# EAGLE design Vario Kobo SIDE V1 (EAGLE 7.3.0)

## Sheet 1 of 2: Alimentation
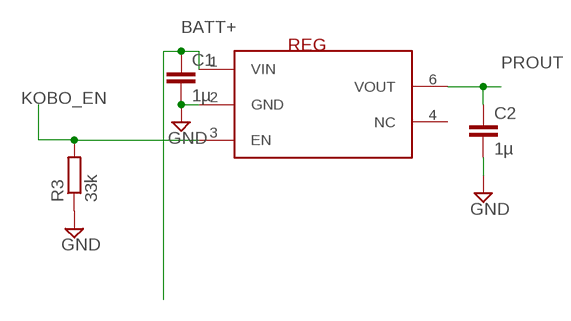
[diagram p0: schematic, sheet 1]

### Parts
C1  1µ  C-EUC0603  [C0603]
C2  1µ  C-EUC0603  [C0603]
R3  33k  R-EU_R0603  [R0603]
REG  ADP160/161/162/163  [TSOT23-6_DDC]

### Nets
BATT+: C1.1 REG.1(VIN) ; also sheet 2
GND: C1.2 C2.2 R3.1 REG.2(GND) ; also sheet 2
KOBO_EN: R3.2 REG.3(EN) ; also sheet 2
PROUT: C2.1 REG.6(VOUT) ; also sheet 2
Unconnected: REG.4(NC)

## Sheet 2 of 2: Vario Core
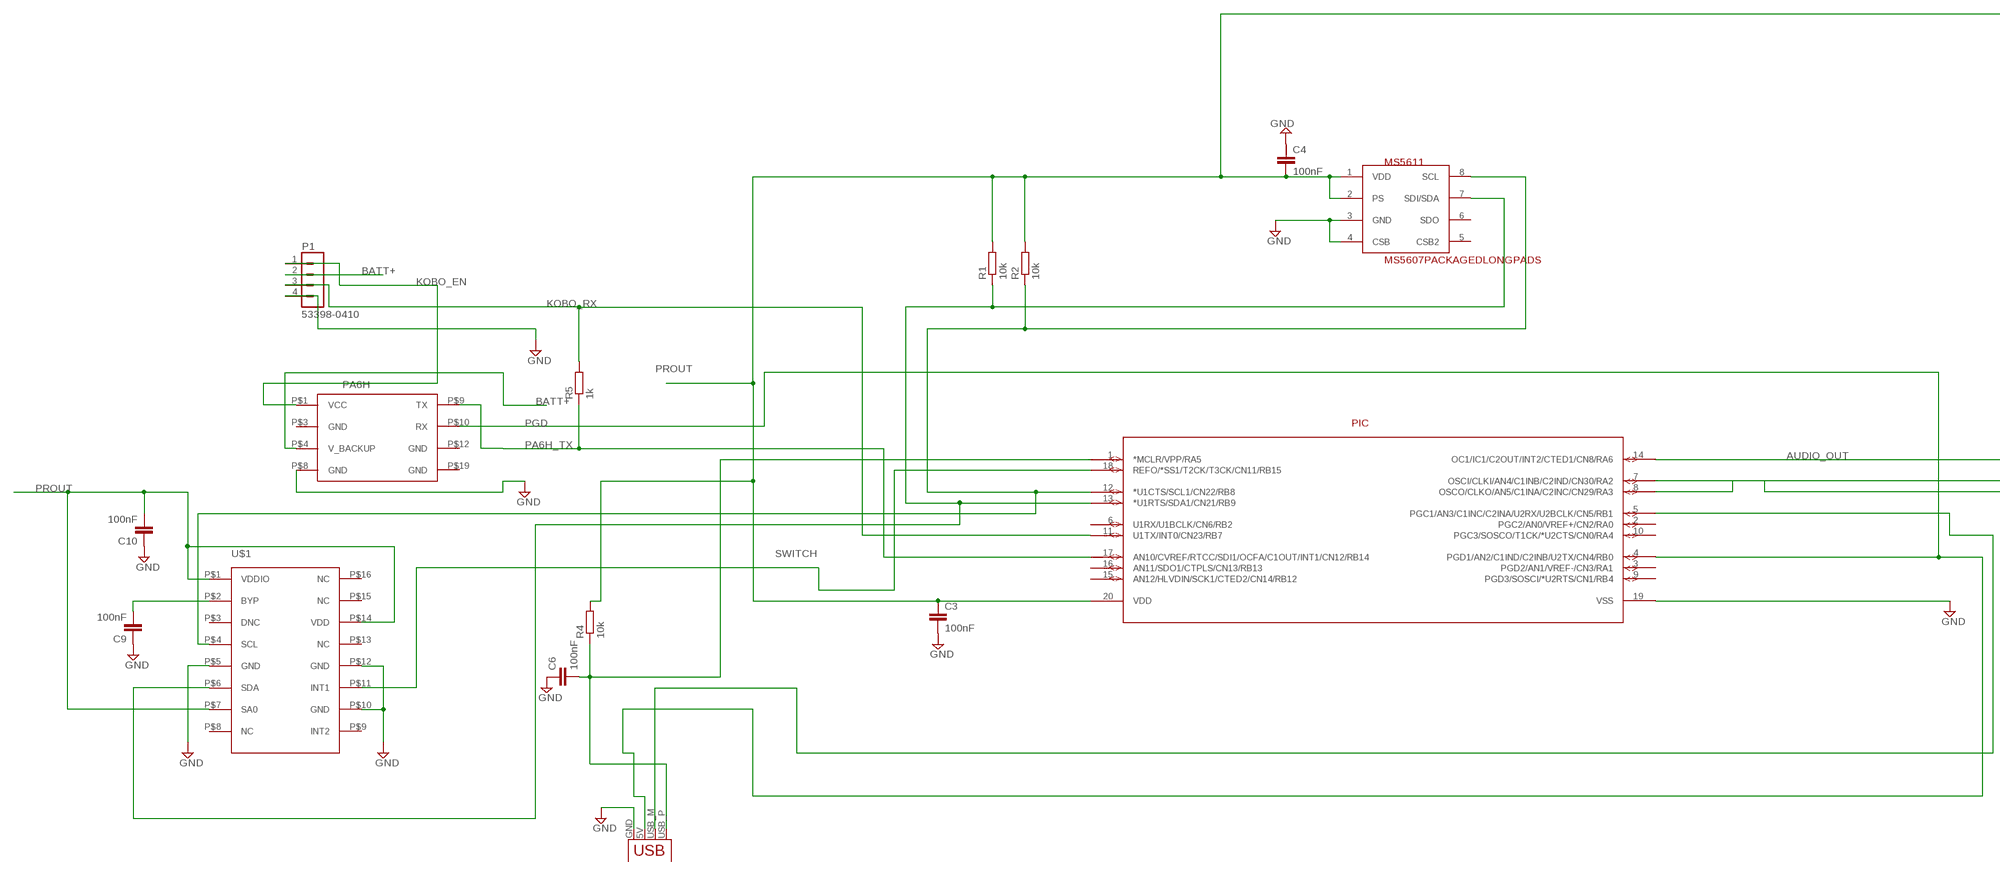
[diagram p1: schematic, sheet 2, part 1 of 2]
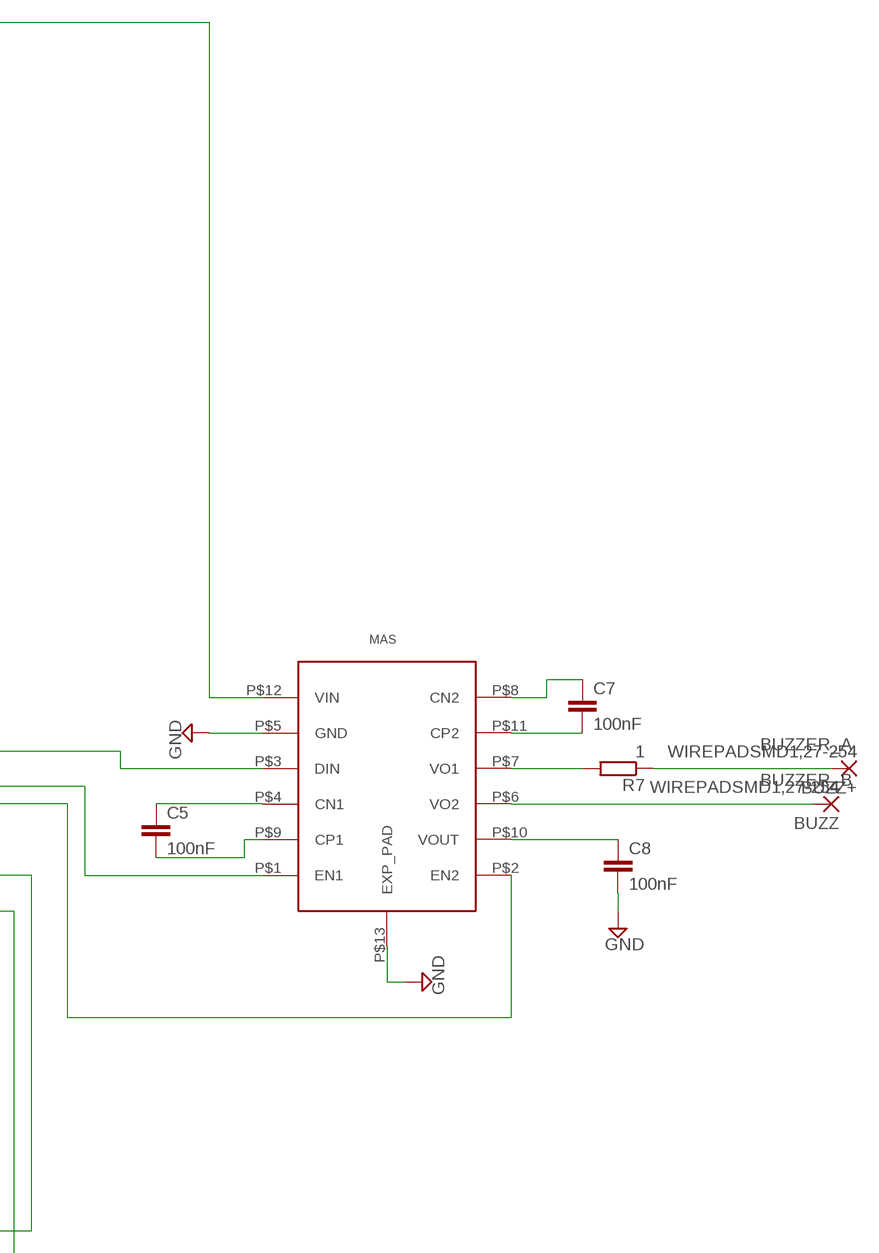
[diagram p2: schematic, sheet 2, part 2 of 2]

### Parts
BUZZ  WIREPADSMD1,27-254  [SMD1,27-2,54]
BUZZ+  WIREPADSMD1,27-254  [SMD1,27-2,54]
C3  100nF  C-EUC0603  [C0603]
C4  100nF  C-EUC0603  [C0603]
C5  100nF  C-EUC0603  [C0603]
C6  100nF  C-EUC0603  [C0603]
C7  100nF  C-EUC0603  [C0603]
C8  100nF  C-EUC0603  [C0603]
C9  100nF  C-EUC0603  [C0603]
C10  100nF  C-EUC0603  [C0603]
MAS  MAS6240  [QFN12_3X3_LONGPADS]
MS5611  MS5607PACKAGEDLONGPADS  [MS5607-02BA03_LONGPADS]
P1  53398-0410  [53398-0410]
PA6H  PA6H  [PA6H_PRINT]
PIC  PIC24F16KA101-X_  [SSOP20_MC]
R1  10k  R-EU_R0603  [R0603]
R2  10k  R-EU_R0603  [R0603]
R4  10k  R-EU_R0603  [R0603]
R5  1k  R-EU_R0603  [R0603]
R7  1  R-EU_R0603  [R0603]
U$1  MMA8452LONGPADS  [MMA845X_LONG_PADS]
X1  USBPCB  [USB-A-PCB]

### Nets
AUDIO_OUT: MAS.P$3(DIN) PIC.14(OC1/IC1/C2OUT/INT2/CTED1/CN8/RA6)
BATT+: P1.2 PA6H.P$4(V_BACKUP) ; also sheet 1
BUZZER_A: BUZZ+.1(P) R7.1
BUZZER_B: BUZZ.1(P) MAS.P$6(VO2)
GND: C3.2 C4.1 C6.1 C8.2 C9.1 C10.1 MAS.P$5(GND) MAS.P$13(EXP_PAD) MS5611.3(GND) MS5611.4(CSB) P1.4 PA6H.P$8(GND) PIC.19(VSS) U$1.P$5(GND) U$1.P$10(GND) U$1.P$12(GND) X1.GND ; also sheet 1
KOBO_EN: P1.1 PA6H.P$1(VCC) ; also sheet 1
KOBO_RX: P1.3 PIC.11(U1TX/INT0/CN23/RB7) R5.2
MCLR: C6.2 PIC.1(*MCLR/VPP/RA5) R4.1 X1.USB_P(D+)
N$3: C8.1 MAS.P$10(VOUT)
N$4: C5.1 MAS.P$4(CN1)
N$5: C5.2 MAS.P$9(CP1)
N$6: C7.2 MAS.P$11(CP2)
N$7: C7.1 MAS.P$8(CN2)
N$8: MAS.P$7(VO1) R7.2
N$9: MAS.P$1(EN1) PIC.8(OSCO/CLKO/AN5/C1INA/C2INC/CN29/RA3)
N$10: C9.2 U$1.P$2(BYP)
N$11: MAS.P$2(EN2) PIC.7(OSCI/CLKI/AN4/C1INB/C2IND/CN30/RA2)
PA6H_TX: PA6H.P$9(TX) PIC.17(AN10/CVREF/RTCC/SDI1/OCFA/C1OUT/INT1/CN12/RB14) R5.1
PGC: PIC.5(PGC1/AN3/C1INC/C2INA/U2RX/U2BCLK/CN5/RB1) X1.USB_M(D-)
PGD: PA6H.P$10(RX) PIC.4(PGD1/AN2/C1IND/C2INB/U2TX/CN4/RB0) X1.5V(VBUS)
PROUT: C3.1 C4.2 C10.2 MAS.P$12(VIN) MS5611.1(VDD) MS5611.2(PS) PIC.20(VDD) R1.2 R2.2 R4.2 U$1.P$1(VDDIO) U$1.P$7(SA0) U$1.P$14(VDD) ; also sheet 1
SCL: MS5611.8(SCL) PIC.12(*U1CTS/SCL1/CN22/RB8) R2.1 U$1.P$4(SCL)
SDA: MS5611.7(SDI/SDA) PIC.13(*U1RTS/SDA1/CN21/RB9) R1.1 U$1.P$6(SDA)
SWITCH: PIC.18(REFO/*SS1/T2CK/T3CK/CN11/RB15) U$1.P$11(INT1)
Unconnected: MS5611.5(CSB2) MS5611.6(SDO) PA6H.P$3(GND) PA6H.P$12(GND) PA6H.P$19(GND) PIC.2(PGC2/AN0/VREF+/CN2/RA0) PIC.3(PGD2/AN1/VREF-/CN3/RA1) PIC.6(U1RX/U1BCLK/CN6/RB2) PIC.9(PGD3/SOSCI/*U2RTS/CN1/RB4) PIC.10(PGC3/SOSCO/T1CK/*U2CTS/CN0/RA4) PIC.15(AN12/HLVDIN/SCK1/CTED2/CN14/RB12) PIC.16(AN11/SDO1/CTPLS/CN13/RB13) U$1.P$3(DNC) U$1.P$8(NC) U$1.P$9(INT2) U$1.P$13(NC) U$1.P$15(NC) U$1.P$16(NC)

## Library data of the parts
BUZZ BUZZ+ = wirepad:WIREPAD: Wire PAD connect wire on PCB
C1-C10 = rcl:C-EU: CAPACITOR, European symbol
MAS = mas:MAS6240
MS5611 = measurement_specialties:MS5607PACKAGED
P1 = con-molex-picoblade:53398-0410: HEADER
PA6H = gtop:PA6H
PIC = microchip:PIC24F16KA101-X_
R1-R5 R7 = rcl:R-EU_: RESISTOR, European symbol
REG = analog-devices:ADP160/161/162/163: LDO, low Iq Linear Voltage Regulator
U$1 = freescale:MMA8452
X1 = usb:USB: USB Connectors USB-B-PTH is fully proven SKU : PRT-00139 USB-miniB is fully proven SKU : PRT-00587 USB-A-PCB is untested. USB-A-H is throughly reviewed, but untested. Spark Fun Electronics SKU : PRT-00437 USB-B-SMT is throughly reviewed, but untested. Needs silkscreen touching up. USB-A-S has not been used/tested USB-MB-H has not been used/tested

## Board
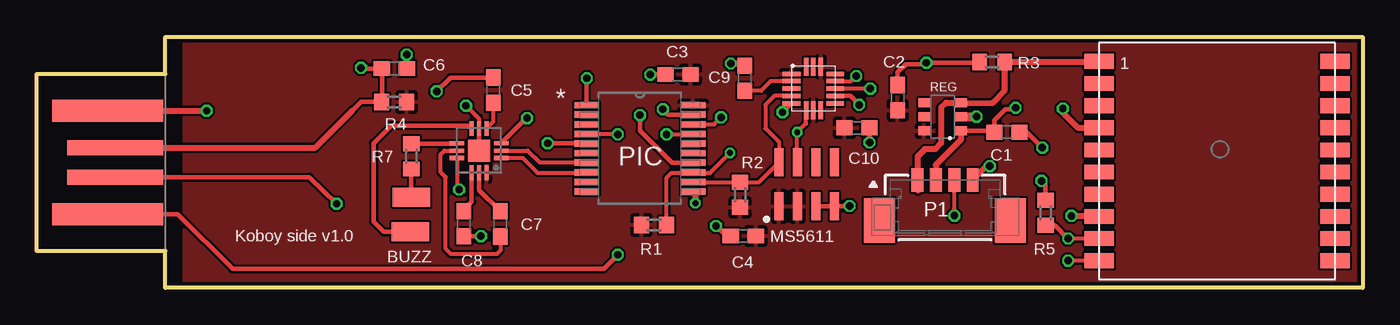
[diagram p3: board, top side]
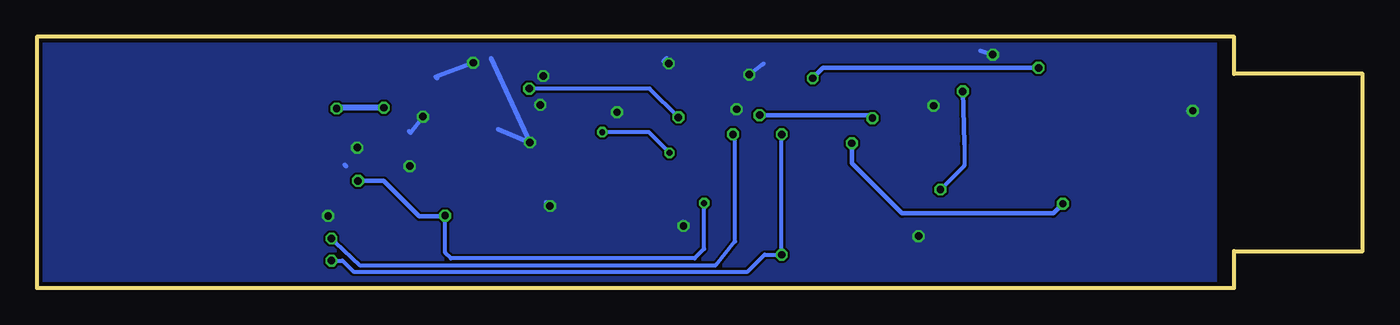
[diagram p4: board, bottom side, seen from below]

Size 89.8 x 17 mm. Coordinates in mm from the lower left corner, seen from the top.
Outline: 0,14.5 8.7,14.5 8.7,17 89.8,17 89.8,0 8.7,0 8.7,2.5 0,2.5 0,14.5
Copper layers (1*16): Top 0.035mm / dielectric 1.5mm / Bottom 0.035mm
Design rules "ITEADstudio_DRC": minimum track width 6mil, minimum drill 12mil, track to track 6mil, track to pad 6mil, pad to pad 6mil, via to via 6mil, smd to smd 0mil, copper to edge 10mil, drill to drill 10mil, minimum pad ring 10mil, minimum via ring 6mil, stop-mask expansion 2mil, vias tented up to drill 100mil, thermal gap 10mil

### Footprints (pad centres in the part's own frame; a part is rotated, then mirrored left to right if it is on the bottom)
SMD1,27-2,54 = smd 1.27 x 2.54: 1 0,0
C0603 = smd 1.1 x 1: 1 -0.85,0; 2 0.85,0
QFN12_3X3_LONGPADS = smd 0.28 x 1: P$1 -0.5,-1.5; P$2 0,-1.5; P$3 0.5,-1.5; P$7 0.5,1.5; P$8 0,1.5; P$9 -0.5,1.5 | smd 1 x 0.28: P$4 1.5,-0.5; P$5 1.5,0; P$6 1.5,0.5; P$10 -1.5,0.5; P$11 -1.5,0; P$12 -1.5,-0.5 | smd 1.5 x 1.5: P$13 0,0
MS5607-02BA03_LONGPADS = smd 1.9 x 0.6: 1 -0.4,0; 2 -0.4,-1.25; 3 -0.4,-2.5; 4 -0.4,-3.75; 5 2.6,-3.75; 6 2.6,-2.5; 7 2.6,-1.25; 8 2.6,0
53398-0410 = smd 0.8 x 1.6: 1 1.875,0; 2 0.625,0; 3 -0.625,0; 4 -1.875,0 | smd 2.1 x 3: M1 4.435,2.75; M2 -4.435,2.75
PA6H_PRINT = smd 2 x 1: P$1 -8,6.75; P$2 -8,5.25; P$3 -8,3.75; P$4 -8,2.25; P$5 -8,0.75; P$6 -8,-0.75; P$7 -8,-2.25; P$8 -8,-3.75; P$9 -8,-5.25; P$10 -8,-6.75; P$11 8,-6.75; P$12 8,-5.25; P$13 8,-3.75; P$14 8,-2.25; P$15 8,-0.75; P$16 8,0.75; P$17 8,2.25; P$18 8,3.75; P$19 8,5.25; P$20 8,6.75
SSOP20_MC = smd 1.676 x 0.432: 1 -3.607,2.921; 2 -3.607,2.286; 3 -3.607,1.626; 4 -3.607,0.965; 5 -3.607,0.33; 6 -3.607,-0.33; 7 -3.607,-0.965; 8 -3.607,-1.626; 9 -3.607,-2.286; 10 -3.607,-2.921; 11 3.607,-2.921; 12 3.607,-2.286; 13 3.607,-1.626; 14 3.607,-0.965; 15 3.607,-0.33; 16 3.607,0.33; 17 3.607,0.965; 18 3.607,1.626; 19 3.607,2.286; 20 3.607,2.921
R0603 = smd 1 x 1.1: 1 -0.85,0; 2 0.85,0
TSOT23-6_DDC = smd 0.6 x 0.8: 1 -0.95,-1.25; 2 0,-1.25; 3 0.95,-1.25; 4 0.95,1.25; 5 0,1.25; 6 -0.95,1.25
MMA845X_LONG_PADS = smd 1.213 x 0.305: P$1 -1.475,1; P$2 -1.475,0.5; P$3 -1.475,0; P$4 -1.475,-0.5; P$5 -1.475,-1; P$9 1.475,-1; P$10 1.475,-0.5; P$11 1.475,0; P$12 1.475,0.5; P$13 1.475,1 | smd 0.305 x 1.213: P$6 -0.5,-1.475; P$7 0,-1.475; P$8 0.5,-1.475; P$14 0.5,1.475; P$15 0,1.475; P$16 -0.5,1.475
USB-A-PCB = smd 7.5 x 1.5: 5V -0.2,-3.5; GND -0.2,3.5 | smd 6.5 x 1: USB_M 0.3,-1; USB_P 0.3,1

### Placement (x,y rotation side)
BUZZ  25.3,3.8 90 top
BUZZ+  25.35,6.15 90 top
C1  65.71,10.55 0 top
C2  58.31,12.89 90 top
C3  43.42,14.46 180 top
C4  47.84,3.53 0 top
C5  30.91,13.4 90 top
C6  24.22,14.85 180 top
C7  31.39,4.34 90 top
C8  28.93,4.35 270 top
C9  47.95,14.2 270 top
C10  55.55,10.85 180 top
MAS  29.95,9.3 90 top
MS5611  50.28,5.93 90 top
P1  61.52,7.31 180 top
PA6H  79.94,8.6 0 top
PIC  40.85,9.45 0 top
R1  41.8,4.27 180 top
R2  47.63,6.31 270 top
R3  64.7,15.31 0 top
R4  24.2,12.6 0 top
R5  68.33,5.09 90 top
R7  25.37,8.91 90 top
REG  61.35,11.6 90 top
U$1  52.6,13.5 0 top
X1  5,8.5 0 top

### Tracks (layer width: path | path; a pad name or v marks a point on that pad's centre or on a via)
AUDIO_OUT  (via drill 0.5)
  Top 0.305: MAS.P$3 33.15,11.5 v33.2,11.5 | v40.85,11.7 40.85,10.65 43.02,8.48 PIC.14
  Bottom 0.305: v33.2,11.5 33.4,11.7 v40.85,11.7
BATT+  (via drill 0.5 pad 0.3)
  Top 0.305: REG.1 64.76,10.65 C1.1 64.85,11.35 65.61,12.11 66.21,12.11
  Top 0.406: 60.94,6.79 P1.2 60.89,8.34 62.6,10.05 REG.1 | 66.21,12.11 v66.3,12.2 | 69.45,12.2 v69.5,12.15 69.5,11.85 70.5,10.85 PA6H.P$4
  Bottom 0.406: v66.3,12.2 69.45,12.2 v69.5,12.15
BUZZER_A
  Top 0.305: R7.1 25.35,8.04 BUZZ+.1
BUZZER_B
  Top 0.305: MAS.P$6 29.25,11 24,11 22.8,9.8 22.8,4.5 23.5,3.8 BUZZ.1
GND  (via drill 0.5)
  Top 0.254: U$1.P$12 55.15,14 v55.5,14.35 | v29.06,12.34 29.95,11.45 MAS.P$5 | 58.86,15.15 58.86,15.06
  Top 0.305: MAS.P$5 MAS.P$13 | C8.2 29.46,3.5 v30.07,3.51 | C6.1 25.07,15.72 v25.05,15.8 | PIC.19 42.76,11.74 v42.4,12.1 | C3.2 41.94,14.46 v41.55,14.45 | U$1.P$5 51.1,12.5 v50.5,11.9 | U$1.P$10 55.1,13 v55.7,12.4 | C10.1 v56.4,9.85 | R3.1 63.85,15.25 v60.25,15.25 60.15,15.15 58.86,15.15 58.31,14.59 C2.2 | MS5611.4 MS5611.3 55.03,5.53 v55.05,5.55 | C4.1 46.67,3.53 v46,4.2 | C1.2 67.05,10.55 v68.1,9.5
  Top 0.406: v70.07,4.88 71.97,4.88 PA6H.P$8 | v64.55,8.25 64.33,8.25 P1.4 | C9.1 47.75,15.2 v47,15.2 | X1.GND v11.5,12
  Top 0.61: REG.2 v63.65,11.6
  Bottom 0.254: v55.5,14.35 55.65,14.35 55.75,14.45
  Bottom 0.305: v25.05,15.8 25.9,16.05 | v42.4,12.1 42.4,12.3 42.45,12.35 | v41.55,14.45 40.7,15.1 40.6,15.2 | v47,15.2 47.15,15.55 47.35,15.35 | v50.5,11.9 50.55,11.9 50.7,11.75 | v55.7,12.4 56,12.4 | 58.55,10.75 v56.4,9.85 59.05,15.55 | v60.25,15.25 62.8,14.3 62.7,14.2 | v63.65,11.6 64.5,10.5 64.6,10.6 | 68.95,8.35 68.85,8.25 | v55.05,5.55 55.3,5.8 | v46,4.2 46,4.45 46.05,4.5
  Bottom 0.406: v11.5,12 11.75,12
  pour Bottom: 10,17 10,0 90,0 90,17
KOBO_EN
  Top 0.406: R3.2 | R3.2 71.9,15.31 PA6H.P$1 | R3.2 65.55,13.4 64.72,12.52 REG.3 61.6,12.55 61.25,12.2 61.25,9.8 60.85,9.4 60.15,9.4 59.65,8.9 P1.1 59.69,6.59
KOBO_RX  (via drill 0.4 pad 0.3, 0.5)
  Top 0.254: v62.15,4.9 P1.3
  Top 0.305: R5.2 68.33,6.97 v68.05,7.25
  Top 0.406: PIC.11 44.57,6.53 v44.6,5.75
  Bottom 0.254: v44.6,5.75 44.6,2.65 45.25,2 61.75,2 62.15,2.4 v62.15,4.9
  Bottom 0.305: v68.05,7.25 66.3,7.25 63.9,4.85 62.2,4.85 v62.15,4.9
MCLR  (via drill 0.5)
  Top 0.305: 21.35,12 21.95,12.6 R4.1 23.37,12.62 C6.2 22,14.86 v21.95,14.9 | PIC.1 v37.24,14.19 v37.25,14.2
  Top 0.406: X1.USB_P 18.85,9.5 21.35,12
  Bottom 0.305: v37.25,14.2 36.55,14.9 v21.95,14.9
N$3
  Top 0.305: C8.1 28.83,5.2 29.45,5.82 MAS.P$10
N$4
  Top 0.254: C5.1 30.91,11.26 MAS.P$4
N$5  (via drill 0.5)
  Top 0.254: MAS.P$9 28.45,6.81 v28.6,6.66
  Top 0.305: C5.2 28.02,14.25 v27.08,13.31
  Bottom 0.254: 26.98,9.76 26.98,8.28 v28.6,6.66
  Bottom 0.305: v27.08,13.31 26.98,9.76
N$6
  Top 0.305: MAS.P$11 29.95,6.62 C7.2
N$7
  Top 0.254: C7.1 31.39,2.54 31.15,2.3 28.05,2.3 27.7,2.65 27.7,7.5 27.35,7.85 27.35,9.05 27.6,9.3 MAS.P$8
  Top 0.305: MAS.P$8 28.16,9.3
N$8
  Top 0.305: MAS.P$7 28.41,9.76 R7.2
N$9
  Top 0.254: MAS.P$1 32.9,8.8 33.9,7.8 37.22,7.8 PIC.8
N$10
  Top 0.254: U$1.P$2 49.7,14 49.05,13.35 C9.2
N$11
  Top 0.254: MAS.P$2 33.25,9.3 34.05,8.5 37.23,8.5 PIC.7
PA6H_TX  (via drill 0.5)
  Top 0.254: PA6H.P$9 v69.85,3.35 | v42.65,10.4 44.44,10.4 PIC.17
  Top 0.305: 71.98,3.4 PA6H.P$9 | R5.1 68.96,4.24 v69.85,3.35
  Bottom 0.254: v69.85,3.35 69.6,3.35 69.6,3.1 67.95,1.55 43.8,1.55 42.5,3.15 42.5,10.25 v42.65,10.4
PGC  (via drill 0.5)
  Top 0.305: X1.USB_M 18.45,7.5 v20.3,5.7 | v34.6,9.8 37.22,9.8 PIC.5
  Bottom 0.305: v20.3,5.7 20.95,5.05 31.2,5.05 34.6,8.45 v34.6,9.8
PGD  (via drill 0.5)
  Top 0.254: PA6H.P$10 v69.85,1.85 | v39.35,10.4 37.26,10.4 PIC.4
  Top 0.305: X1.5V 9.55,5 13.25,1.3 38.4,1.3 v39.35,2.25
  Bottom 0.254: v39.35,10.4 v39.35,2.25 40.5,2.25 41.65,1.1 68.35,1.1 69.1,1.85 v69.85,1.85
PROUT
  pour Top: 10,17 90,17 90,0 10,0
SCL
  Top 0.254: PIC.12 R2.1 48.92,7.16 MS5611.8 50.25,8.55 50.25,9.9 49.35,10.8 49.35,12.4 49.95,13 U$1.P$4
SDA  (via drill 0.4 pad 0.25)
  Top 0.254: 44.48,7.8 45.6,7.8 v46.95,9.15 | MS5611.7 51.5,8.53 v51.5,10.55 52.1,11.15 U$1.P$6 | R1.1 42.65,7.45 43,7.8 44.43,7.8 PIC.13
  Top 0.305: PIC.13 44.48,7.8
  Bottom 0.254: v46.95,9.15 48.35,10.55 v51.5,10.55
SWITCH  (via drill 0.5)
  Top 0.254: PIC.18 45.88,11.08 v46.35,11.55 | v56.45,13.5 U$1.P$11
  Bottom 0.254: v46.35,11.55 48.3,13.5 v56.45,13.5

### Text on the board
tPlace: Koboy side v1.0
tNames: 1